# Altium schematic sheet Project_design.SchDoc
size A2; SheetNumber: 1; SheetTotal: 1
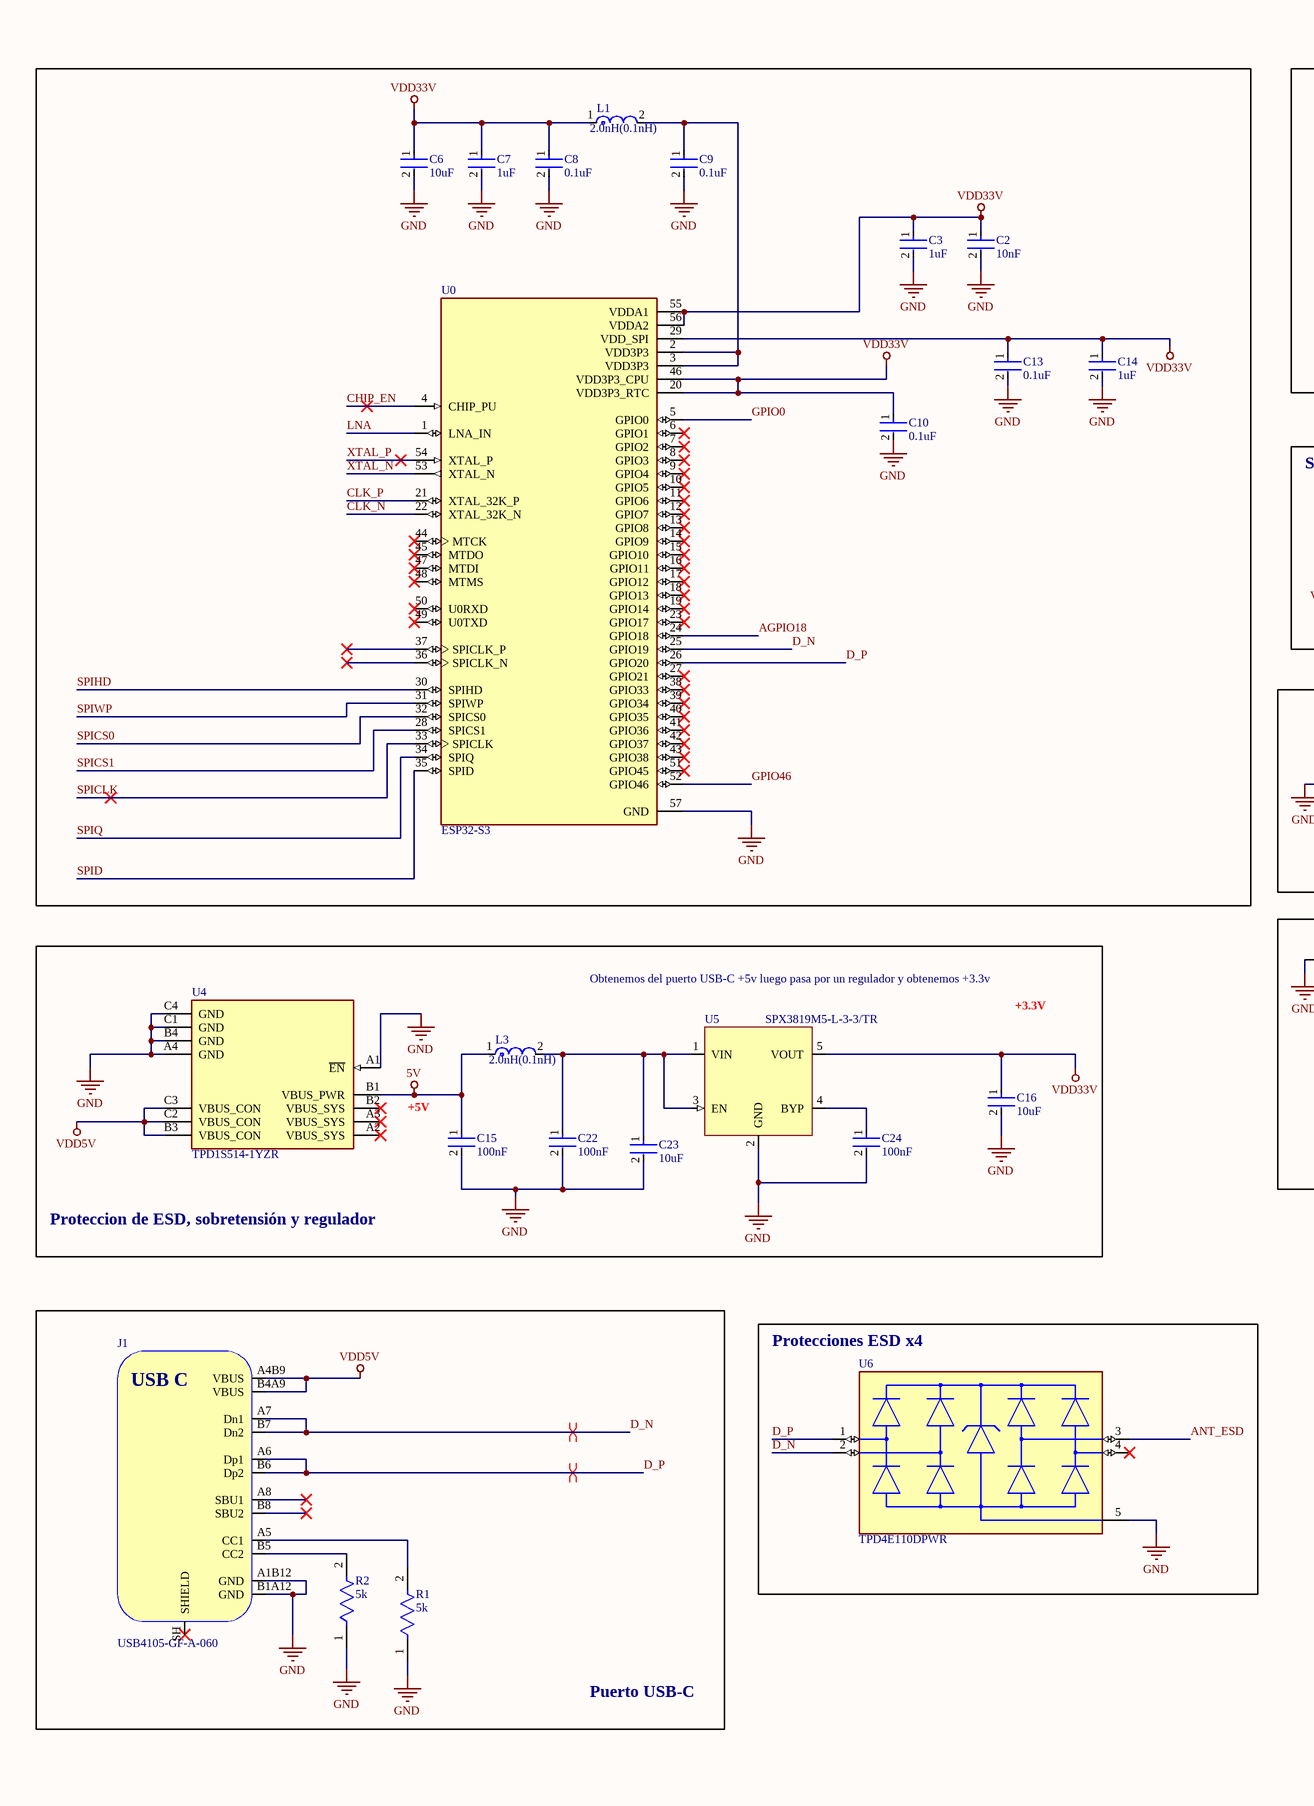
[diagram p0: Project_design.SchDoc, left]
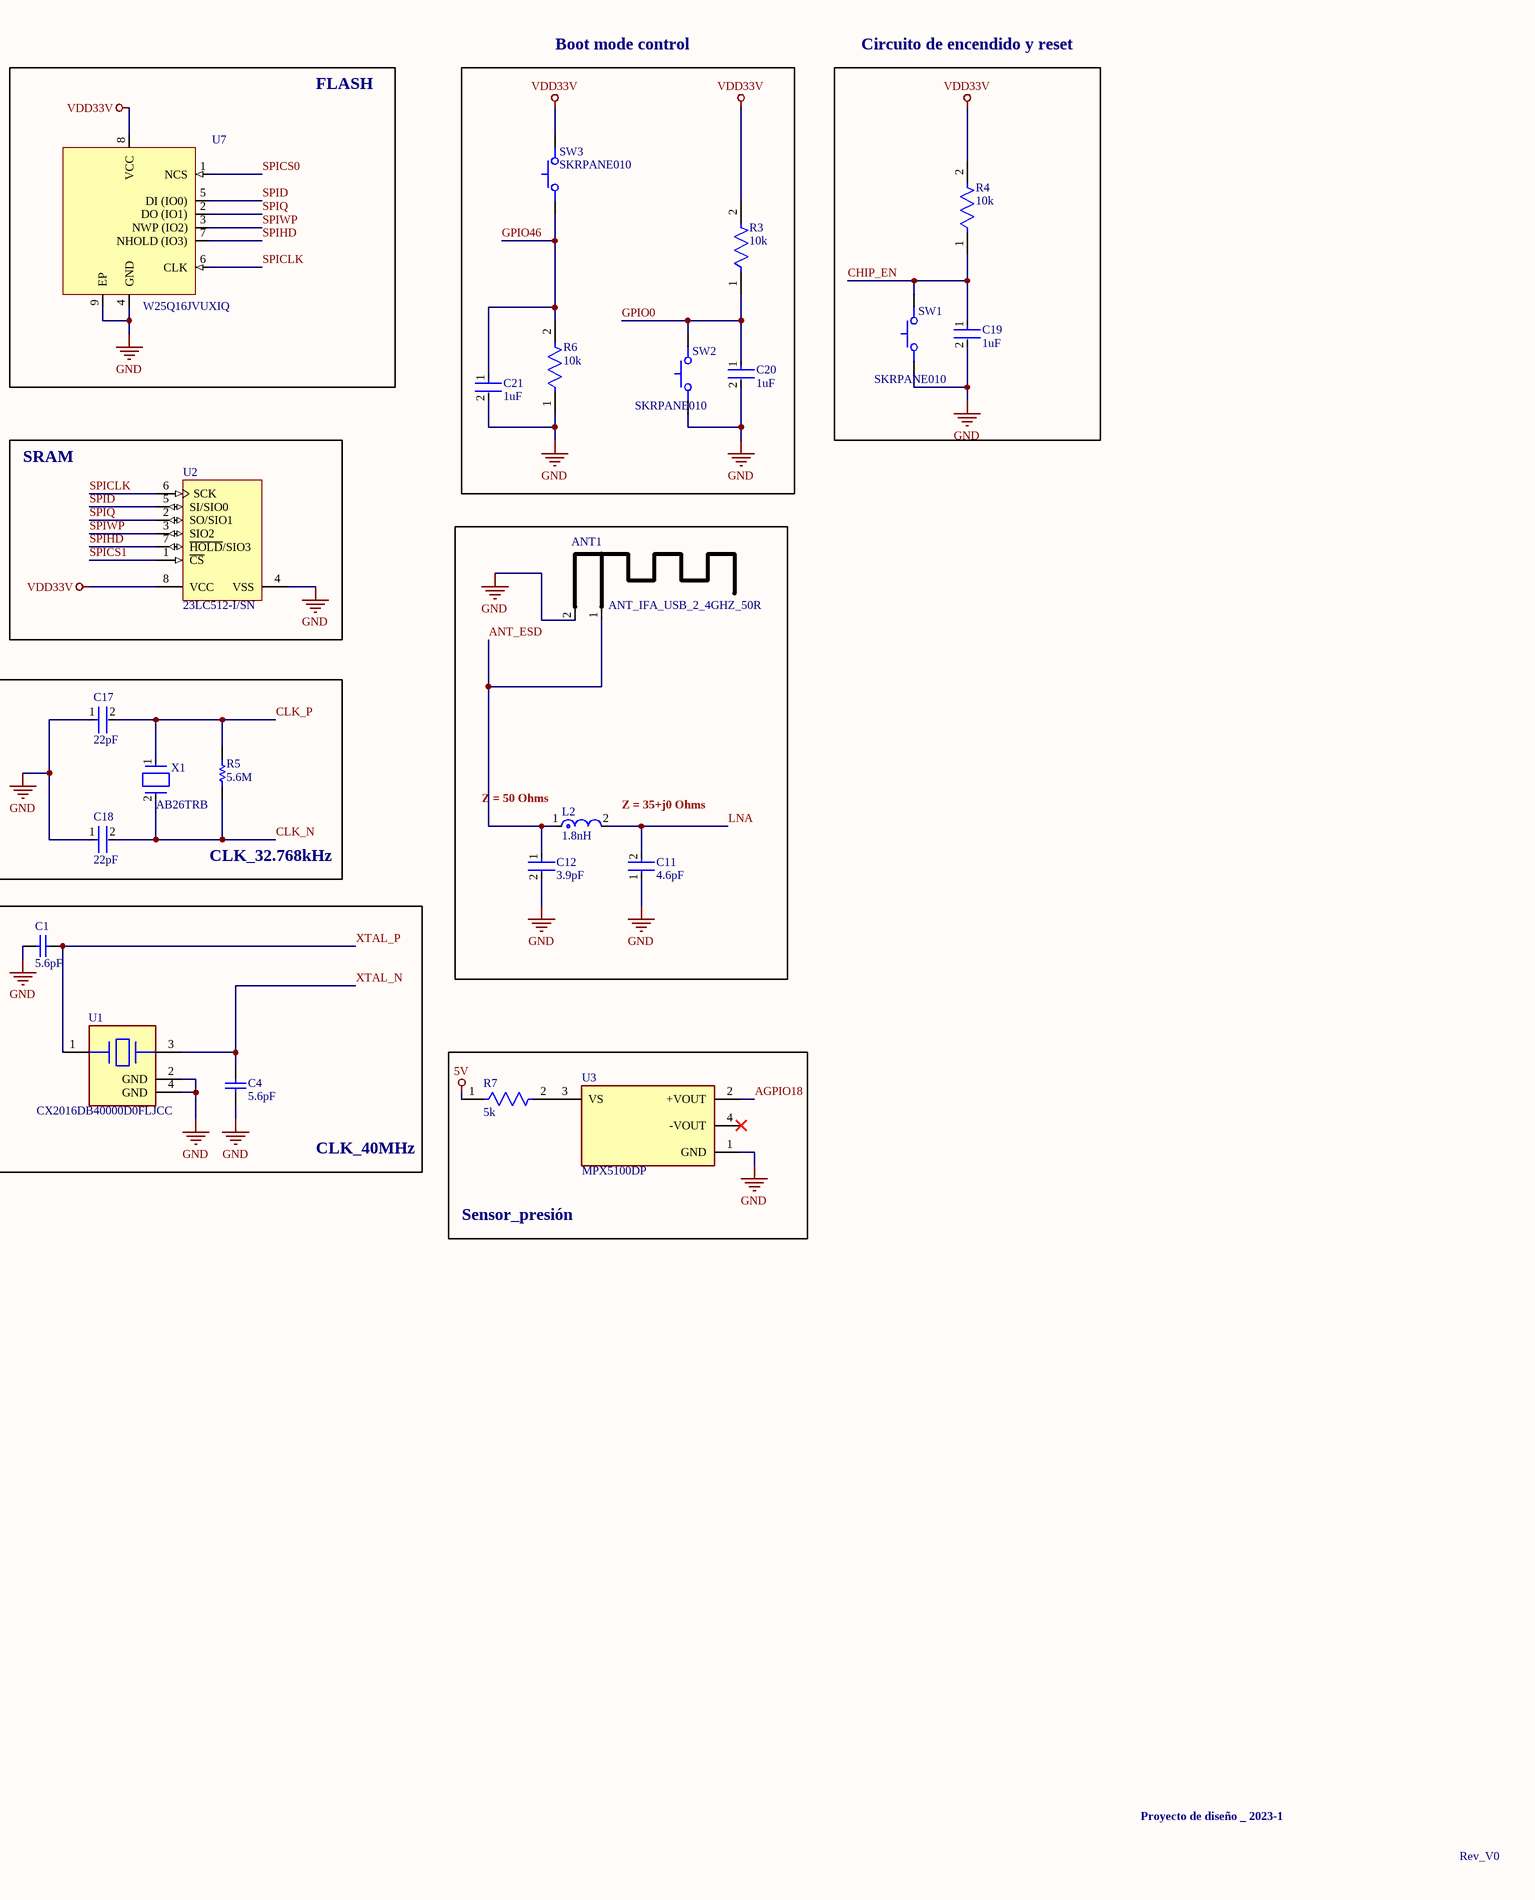
[diagram p1: Project_design.SchDoc, right]

## Parts
ANT1  ANT_IFA_USB_2_4GHZ_50R  [ANT_IFA_USB_2_4GHZ_50R]  (no BOM)
C1  5.6pF  [CAPC1006X50X20LL10T10]
C2  10nF  [FP-GRM033-0_03-IPC_B]
C3  1uF  [FP-C0402C105K9PACTU-MFG]
C4  5.6pF  [CAPC1006X50X20LL10T10]
C6  10uF  [FP-GRM155-0_2-IPC_C]
C7  1uF  [FP-C0402C105K9PACTU-MFG]
C8  0.1uF  [FP-CL278-IPC_C]
C9  0.1uF  [FP-CL278-IPC_C]
C10  0.1uF  [FP-CL278-IPC_C]
C11  4.6pF  [FP-CBR04C-MFG]
C12  3.9pF  [FP-GRM033-0_03-IPC_B]
C13  0.1uF  [FP-CL278-IPC_C]
C14  1uF  [FP-C0402C105K9PACTU-MFG]
C15  100nF  [FP-CL278-IPC_C]
C16  10uF  [FP-GRM155-0_2-IPC_C]
C17  22pF  [FP-C0603C-CF-MFG]
C18  22pF  [FP-C0603C-CF-MFG]
C19  1uF  [FP-C0402C105K9PACTU-MFG]
C20  1uF  [FP-C0402C105K9PACTU-MFG]
C21  1uF  [FP-C0402C105K9PACTU-MFG]
C22  100nF  [FP-CL278-IPC_C]
C23  10uF  [FP-GRM155-0_2-IPC_C]
C24  100nF  [FP-CL278-IPC_C]
J1  USB4105-GF-A-060  [USB4105-GF-A-060]
L1  2.0nH(0.1nH)  [FP-LQG15HH_02-MFG]
L2  1.8nH  [FP-LQP03TG_02-IPC_B]
L3  2.0nH(0.1nH)  [FP-LQG15HH_02-MFG]
R1  5k  [FP-PNM0402-IPC_C]
R2  5k  [FP-PNM0402-IPC_C]
R3  10k  [FP-CRGP0603-IPC_C]
R4  10k  [FP-CRGP0603-IPC_C]
R5  5.6M  [RESC1005X40X25ML05T10]
R6  10k  [FP-CRGP0603-IPC_C]
R7  5k  [FP-PNM0402-IPC_C]
SW1  SKRPANE010  [SKRPANE010]
SW2  SKRPANE010  [SKRPANE010]
SW3  SKRPANE010  [SKRPANE010]
U0  ESP32-S3  [IC_ESP32-S3]
U1  CX2016DB40000D0FLJCC  [FP-CX2016DB-MFG]
U2  23LC512-I/SN  [MCHP-SOIC-SN8_N]
U3  MPX5100DP  [FP-SOT1754-1-MFG]
U4  TPD1S514-1YZR  [BGA12N40P3X4_140X189X62N]
U5  SPX3819M5-L-3-3/TR  [SOT-23-5]
U6  TPD4E110DPWR  [FP-DPW0004A-MFG]
U7  W25Q16JVUXIQ  [USON-8-2X3MM]
X1  AB26TRB  [FP-AB26TRB-MFG]

## Blocks framed on the sheet
FLASH: U7
Boot mode control: C20 C21 R3 R6 SW2 SW3
Circuito de encendido y reset: C19 R4 SW1
SRAM: U2
CLK_32.768kHz: C17 C18 R5 X1
CLK_40MHz: C1 C4 U1
Proteccion de ESD, sobretensión y regulador: C15 C16 C22-C24 L3 U4 U5
Sensor_presión: R7 U3
Puerto USB-C: J1 R1 R2
Protecciones ESD x4: U6

## Nets
5V: C15.1 L3.1 R7.1 U4.B1(VBUS_PWR)
GND: ANT1.2(GND) C1.1 C2.2 C3.2 C4.1 C6.2 C7.2 C8.2 C9.2 C10.2 C11.1 C12.2 C13.2 C14.2 C15.2 C16.2 C17.1 C18.1 C19.2 C20.2 C21.2 C22.2 C23.2 C24.2 J1.A1B12(GND) J1.B1A12(GND) R1.1 R2.1 R6.1 SW1.12 SW2.12 U0.57(GND) U1.2(GND) U1.4(GND) U2.4(VSS) U3.1(GND) U4.A1(~{EN}) U4.A4(GND) U4.B4(GND) U4.C1(GND) U4.C4(GND) U5.2(GND) U6.5(GND) U7.4(GND) U7.9(EP)
VDD5V: J1.A4B9(VBUS) J1.B4A9(VBUS) U4.B3(VBUS_CON) U4.C2(VBUS_CON) U4.C3(VBUS_CON)
VDD33V: C2.1 C3.1 C6.1 C7.1 C8.1 C10.1 C13.1 C14.1 C16.1 L1.1 R3.2 R4.2 SW3.34 U0.20(VDD3P3_RTC) U0.29(VDD_SPI) U0.46(VDD3P3_CPU) U0.55(VDDA1) U0.56(VDDA2) U2.8(VCC) U5.5(VOUT) U7.8(VCC)
AGPIO18: U0.24(GPIO18) U3.2(+VOUT)
ANT_ESD: ANT1.1(RF) C12.1 L2.1 U6.3(IO3)
CHIP_EN: C19.1 R4.1 SW1.34 U0.4(CHIP_PU)
CLK_N: C18.2 R5.1 U0.22(XTAL_32K_N) X1.2
CLK_P: C17.2 R5.2 U0.21(XTAL_32K_P) X1.1
D_N: J1.A7(Dn1) J1.B7(Dn2) U0.25(GPIO19) U6.2(IO2)
D_P: J1.A6(Dp1) J1.B6(Dp2) U0.26(GPIO20) U6.1(IO1)
GPIO0: C20.1 R3.1 SW2.34 U0.5(GPIO0)
GPIO46: C21.1 R6.2 SW3.12 U0.52(GPIO46)
LNA: C11.2 L2.2 U0.1(LNA_IN)
SPICLK: U0.33(SPICLK) U2.6(SCK) U7.6(CLK)
SPICS0: U0.32(SPICS0) U7.1(NCS)
SPICS1: U0.28(SPICS1) U2.1(~{CS})
SPID: U0.35(SPID) U2.5(SI/SIO0) U7.5(DI_(IO0))
SPIHD: U0.30(SPIHD) U2.7(~{HOLD}/SIO3) U7.7(NHOLD_(IO3))
SPIQ: U0.34(SPIQ) U2.2(SO/SIO1) U7.2(DO_(IO1))
SPIWP: U0.31(SPIWP) U2.3(SIO2) U7.3(NWP_(IO2))
XTAL_N: C4.2 U0.53(XTAL_N) U1.3
XTAL_P: C1.2 U0.54(XTAL_P) U1.1
NetC9_1: C9.1 L1.2 U0.2(VDD3P3) U0.3(VDD3P3)
NetC22_1: C22.1 C23.1 L3.2 U5.1(VIN) U5.3(EN)
NetC24_1: C24.1 U5.4(BYP)
NetJ1_A5: J1.A5(CC1) R1.2
NetJ1_B5: J1.B5(CC2) R2.2
NetR7_2: R7.2 U3.3(VS)

Not connected (* = marked no-connect by the designer): J1 A8(SBU1)* B8(SBU2)* SH(SHIELD)*; U0 6(GPIO1)* 7(GPIO2)* 8(GPIO3)* 9(GPIO4)* 10(GPIO5)* 11(GPIO6)* 12(GPIO7)* 13(GPIO8)* 14(GPIO9)* 15(GPIO10)* 16(GPIO11)* 17(GPIO12)* 18(GPIO13)* 19(GPIO14)* 23(GPIO17)* 27(GPIO21)* 36(SPICLK_N)* 37(SPICLK_P)* 38(GPIO33)* 39(GPIO34)* 40(GPIO35)* 41(GPIO36)* 42(GPIO37)* 43(GPIO38)* 44(MTCK)* 45(MTDO)* 47(MTDI)* 48(MTMS)* 49(U0TXD)* 50(U0RXD)* 51(GPIO45)*; U3 4(-VOUT)*; U4 A2(VBUS_SYS)* A3(VBUS_SYS)* B2(VBUS_SYS)*; U6 4(IO4)*

## Layout directives
differential pair: D_N, D_P

## Notes on the sheet
- (near L2) Z = 50 Ohms
- (near L2) Z = 35+j0 Ohms
- Obtenemos del puerto USB-C +5v luego pasa por un regulador y obtenemos +3.3v
- +3.3V
- +5V
- Proyecto de diseño _ 2023-1
- Rev_V0
- (in symbol CMP-002-00129-1) USB C

## Library data of the parts
ANT1 = CMP-027-000136-1: Inverted F 2.4GHz ISM PCB Antenna 50 Ohm; Source: Schematic-Lib-PhilsLab.SchLib; Design Item ID: ANT_IFA_USB_2_4GHZ_50R; ComponentLink1URL: https://www.ti.com/lit/an/swra117d/swra117d.pdf; ComponentLink1Description: Datasheet
C1 C4 = CMP-2008-04814-1: Manufacturer: AVX Interconnect / Elco; Part Number: 04023J5R6BBSTR
C2 = CMP-2010-01684-2: Chip Multilayer Ceramic Capacitors for General Purpose, 0201, 10000pF, X7R, 15%, 10%, 10V; Package Quantity: 1; Width: 0.012inch; Voltage: 10V; Mount: Surface Mount; Capacitance: 10nF; Voltage Rating (DC): 10V; Voltage Rating: 10V; Length: 0.6mm; Packaging: Tape and Reel; Material: Ceramic; Dielectric: X7R; REACH SVHC: No SVHC; Termination: SMD/SMT; Case/Package: 0201; Radiation Hardening: No; Height: 0.3mm; Tolerance: 10%; Case Code (Imperial): 0201; Min Operating Temperature: -55°C; Lead Free: Lead Free; Thickness: 0.013inch; Depth: 0.3mm; Case Code (Metric): 0603; Max Operating Temperature: 125°C
C3 C7 C14 C19-C21 = CMP-2008-02075-2: CAP CER 1UF 6.3V X5R 0402; Tolerance: 10%; Dielectric Material: Ceramic; Series: C; Lead Free: Lead Free; Min Operating Temperature: -55°C; Capacitance: 1uF; Voltage Rating (DC): 6.3V; Number of Pins: 2; REACH SVHC: No SVHC; Mount: Surface Mount; Lead Pitch: 0.3mm; Case Code (Imperial): 0402; RoHS Compliant: Yes; Radiation Hardening: No; Construction: Flat; Depth: 0.5mm; Case/Package: 0402; Termination: SMD/SMT; Height: 0.5mm; Thickness: 0.022inch; Voltage: 6.3V; Dielectric: X5R; Width: 0.02inch; Voltage Rating: 6.3V; Max Operating Temperature: 85°C; Packaging: Tape and Reel; Package Quantity: 1; Length: 1mm
C6 C16 C23 = CMP-06035-044652-1: Chip Multilayer Ceramic Capacitors for General Purpose, 0402, 10uF, X5R, 15%, 20%, 6.3V
C8-C10 C13 C15 C22 C24 = CMP-13271-000728-1: Cap Ceramic 100nF 25V X5R ±10% SMD 0402 +85°C Paper T/R; Package Quantity: 1; Height: 0.5mm; Case Code (Metric): 1005; Thickness: 0.022inch; Mount: Surface Mount; Lead Free: Lead Free; Case Code (Imperial): 0402; Packaging: Tape and Reel; Depth: 0.5mm; Voltage: 25V; Min Operating Temperature: -55°C; Voltage Rating: 25V; Dielectric: X5R; Case/Package: 0402; Tolerance: 10%; Width: 0.02inch; Max Operating Temperature: 85°C; Capacitance: 100nF; Length: 1mm; Radiation Hardening: No; Voltage Rating (DC): 25V
C11 = CMP-03020-033502-1: CBR0402 4.6 pF 30ppm/°C 0.1 pF C0G 50 V; Manufacturer Part Number: CBR04C469B5GAC; Manufacturer: KEMET; Tolerance: 0.1 pF; Voltage Rating: 50 V; Material: Ceramic; Device Class L1: Passive Components; Package: CBR04C; Value: 4.6 pF; ComponentLink2Description: Datasheet; Automotive: No; Device Class L2: Capacitors; Device Class L3: Ceramic Capacitors; Temperature: -55°C to +125°C; Category: Cap; Temperature Coefficient: 30ppm/°C; Lead Free: Yes; Temperature Characteristic: C0G; Mouser Description: Cap Ceramic 4.6pF 50V C0G 0.1pF SMD 0402 125°C Paper T/R; Capacitance: 4.6 pF; Ipc Land Pattern Name: CAPC10050X50; Height: 0.55mm; RoHS: TRUE; ComponentLink2URL: https://content.kemet.com/datasheets/KEM_C1030_CBR_SMD.pdf; Octopart: https://octopart.com/cbr04c469b5gac-kemet-86730458; Temperature Range High: +125°C; Temperature Range Low: -55°C
C12 = CMP-2010-01120-2: Chip Multilayer Ceramic Capacitors for General Purpose, 0201, 3.9pF, C0G, 30ppm/°C, 0.25pF, 50V; Width: 0.012inch; Thickness: 0.013inch; Length: 0.024inch; Voltage Rating (DC): 50V; Case/Package: 0201; Termination: SMD/SMT; Min Operating Temperature: -55°C; Voltage Rating: 50V; Packaging: Tape and Reel; Max Operating Temperature: 125°C; Capacitance: 3.9pF; Mount: Surface Mount; Package Quantity: 15000
C17 C18 = CMP-2006-03119-3: Cap Ceramic 22pF 50V C0G 5% SMD 0603 125°C Paper T/R; Manufacturer Part Number: C0603C220J5GACTU; Manufacturer: KEMET; Temperature Coefficient: 30ppm/°C; Automotive Grade: Grade 1; Tolerance: 0.05; RoHS: TRUE; Temperature Characteristic: C0G; Capacitance: 22 pF; Device Class L3: Ceramic Capacitors; Digikey Description: Cap Ceramic 22pF 50V C0G 5% SMD 0603 125°C Paper T/R; ComponentLink2URL: https://api.kemet.com/component-edge/download/datasheet/C0603C100J5GACAUTO.pdf; ComponentLink2Description: Datasheet; Automotive: Yes; Temperature: -55°C to +125°C; Temperature Range High: +125°C; Package: C0603C-CF; Device Class L1: Passive Components; Device Class L2: Capacitors; Lead Free: Yes; Value: 22 pF; Category: Cap; Mouser Description: Cap Ceramic 22pF 50V C0G 5% SMD 0603 125°C Paper T/R; Voltage Rating: 50 V; Height: 0.87mm; Material: Ceramic; Temperature Range Low: -55°C; Octopart: https://octopart.com/c0603c220j5gactu-kemet-98525
J1 = CMP-002-00129-1: USB Connector Type C SMT 12 Pin; Manufacturer: GCT; Distributor Link: https://eu.mouser.com/ProductDetail/GCT/USB4105-GF-A-060?qs=QNEnbhJQKvY2mocwNJzgfA%3D%3D; Manufacturer Part Number: USB4105-GF-A-060; Source: Schematic-Lib-PhilsLab.SchLib; Design Item ID: USB4105-GF-A-060
L1 L3 = CMP-06042-013960-1: Multilayer type RF Inductor 2nH ±0.1nH 0.09Ω 900mA 0402
L2 = CMP-06042-011516-1: Film type RF Inductor 1.8nH ±0.1nH 600mA 0.15Ω 0201 (0603); Self Resonant Frequency: 6GHz; Current: 450mA; Q Factor: 14; Test Frequency: 500MHz; Shielding: Unshielded; DC Resistance (DCR): 150mR; Core Material: Non-Magnetic; Termination: SMD/SMT; Height - Seated (Max): 0.013inch; Package Quantity: 15000; Case/Package: 0201; Depth: 0.33mm; REACH SVHC: No SVHC; Length: 0.024inch; Case Code (Imperial): 0201; DC Current: 600mA; Packaging: Tape and Reel; Current Rating: 600mA; Radiation Hardening: No; Inductance: 1.8nH; Resistor Type: Thin Film; Mount: Surface Mount; Max Operating Temperature: 125°C; Height: 0.012inch; Case Code (Metric): 0603; Military Standard: Not; Min Operating Temperature: -55°C; Width: 0.012inch; Max DC Current: 600mA
R1 R2 R7 = CMP-02407-012302-1: RES SMD 5K OHM 0.1% 1/20W 0402; Temperature Coefficient: 25ppm/°C; Resistance: 5kR; Max Power Dissipation: 50mW; Width: 0.022inch; Height: 0.033inch; Tolerance: 0.1%; Number of Terminations: 2; Packaging: Tape and Reel; RoHS Compliant: Yes; Case Code (Imperial): 0402; Min Operating Temperature: -55°C; Case Code (Metric): 1005; Features: Moisture Resistant; Max Operating Temperature: 155°C; Package Quantity: 1000; Resistor Type: Thin Film; Length: 0.042inch; Case/Package: 0402
R3 R4 R6 = CMP-03211-004414-1: CRGP 0603 10K 1%; Manufacturer Part Number: CRGP0603F10K; Manufacturer: TE; Voltage Rating: 50V; Power Rating: 0.25W; Value: 10KΩ; Tolerance: 0.01; Temperature Coefficient: ±100ppm/°C; Octopart: https://octopart.com/crgp0603f10k-te+connectivity-91018721; Temperature Range Low: -55°C; Temperature Range High: +155°C; Device Class L3: Chip SMD Resistors; Package: CRGP0603; Height: 0.55mm; Series: CRGP; RoHS: TRUE; Composition: Thick Film; Digikey Description: CRGP 0603 10K 1%; Ipc Land Pattern Name: RESC16080X45; Mouser Description: Res, 10K, 1%, 0.25W, 0603, Thick Film; ComponentLink2Description: Datasheet; ComponentLink2URL: https://www.te.com/commerce/DocumentDelivery/DDEController?Action=srchrtrv&DocNm=9-1773463-9&DocType=DS&DocLang=English; Temperature: -55°C to +155°C; Device Class L1: Passive Components; Lead Free: Yes; Ambient Temperature Range High: +70°C; Device Class L2: Resistors; Automotive: No; Category: Res; Resistance: 10KΩ
R5 = CMP-2002-07139-1: Manufacturer: Yageo / Phycomp; Part Number: RC0402JR-075M6L
SW1-SW3 = SKRPANE010: Tactile Switch SMD SPST; Manufacturer: Alps Alpine; Manufacturer Part Number: SKRPANE010
  SW1: Supplier 1: Mouser; Supplier Part Number 1: 688-SKRPANE010
U0 = CMP-031-00008-2: IC RF TxRx + MCU Bluetooth, WiFi 802.11b/g/n, Bluetooth v5.0 2.412GHz ~ 2.484GHz 56-VFQFN Exposed Pad; MF: Espressif Systems; Availability: In Stock; Value: *; Pins: 57; Price: None; Purchase-URL: https://pricing.snapeda.com/search/part/ESP32-S3/?ref=eda; Component Type: Standard; Case/Package: None; Check_prices: https://www.snapeda.com/parts/ESP32-S3/Espressif+Systems/view-part/?ref=eda; Design Item ID: ESP32-S3; MP: ESP32-S3; Source: ESP32-S3.SchLib; SnapEDA_Link: https://www.snapeda.com/parts/ESP32-S3/Espressif+Systems/view-part/?ref=snap
U1 = CMP-20727-000002-1: CRYSTAL 40.0000MHZ 8PF SMD; Manufacturer: Kyocera International Inc. Electronic Components; Esr: 50Ω; Tolerance: 15ppm; Frequency: 40MHz; Series: CX2016DB; RoHS: TRUE; Temperature Range High: +85°C; Height: 0.45mm; Manufacturer Part Number: CX2016DB40000D0FLJCC; ComponentLink2Description: Datasheet; Load Capacitance: 8pF; ComponentLink2URL: https://global.kyocera.com/prdct/electro/product/pdf/cx2016db_e.pdf; Temperature: -30°C to +85°C; Device Class L2: Crystals / Oscillators; Category: Crys; Mouser Description: Crystal 40MHz 8pF 4-Pin SMD T/R; Lead Free: Yes; Device Class L3: Crystals; Temperature Range Low: -30°C; Octopart: https://octopart.com/cx2016db40000d0fljcc-avx+%2F+kyocera-71139660; Device Class L1: Passive Components; Automotive: No; Digikey Description: CRYSTAL 40.0000MHZ 8PF SMD; Package: CX2016DB; Stability: 15ppm
U2 = CMP-0163-00041-1: 512K bits SPI Serial SRAM with SDI and SQI Interface, 2.5 to 5.5 V, 20 MHz, -40 to 85 degC, 8-pin SOIC (SN8), Tube; Manufacturer: Microchip; ComponentLink1Description: Manufacturer URL; DatasheetVersion: Rev. A; ComponentLink3Description: Package Specification; ComponentLink2URL: http://ww1.microchip.com/downloads/en/DeviceDoc/25155A.pdf; ComponentLink4Description: Product URL; ComponentLink4URL: http://www.microchip.com/23LC512; PackageReference: SOIC-SN8; PackageVersion: C04-057C; ComponentLink1URL: http://www.microchip.com; ComponentLink2Description: Datasheet; PackageDescription: 8-Lead Plastic Small Outline, 4.9 x 3.9 mm Body, 1.27 mm Pitch; ComponentLink3URL: http://www.microchip.com/stellent/groups/techpub_sg/documents/packagingspec/en012702.pdf; PartNumber: 23LC512-I/SN; Mounting Technology: Surface Mount
U3 = CMP-00561-70301700-1: Pressure Sensor 14.5PSI (100kPa) Differential Male - 0.19 (4.93mm) Tube, Dual 0.2 V ~ 4.7 V 6-SIP Module; Accuracy: 0.4%; Port Style: Barbed; Min Supply Voltage: 3V; Response Time: 1ms; Max Pressure: 25.38PSI; Operating Supply Current: 6mA; Output Type: Wheatstone Bridge; Max Supply Voltage: 6V; Height: 33.09mm; NexarPartId: 70301700; Case/Package: SIP; Weight: 5.057838g; Max Operating Temperature: 125°C; REACH SVHC: No SVHC; Min Operating Temperature: -40°C; Lead Free: Lead Free; Termination: PCB; Nominal Supply Current: 6mA; Packaging: Bulk; Radiation Hardening: No; Mount: Through Hole; RoHS: Compliant; Number of Pins: 4; Pressure Type: Differential; Ambient Temperature Range High: 125°C; Schedule B: 8541500080, 8542390000
U4 = CMP-003-000016-2: Interface Circuit, PBGA12; MF: Texas Instruments; Max Supply Voltage: 5.9V; Min Supply Voltage: 3.5V; Texas_Instruments-Purchase-URL: https://snapeda.com/shop?store=Texas+Instruments&id=382764; Availability: Good; JESD-609 Code: e1; Value: *; Max Operating Temperature: 85°C; Component Type: Standard; Source: TPD1S514-1YZR.SchLib; Package: DSBGA-12 Texas Instruments; MP: TPD1S514-1YZR; Pins: 12; Case/Package: VFBGA; Height - Seated (Max): 0.625mm; Pin Count: 12; SnapEDA_Link: https://www.snapeda.com/parts/TPD1S514-1YZR/Texas%20Instruments/view-part/382764/?ref=snap; Interface IC Type: INTERFACE CIRCUIT; Min Operating Temperature: -40°C; DigiKey-Purchase-URL: https://snapeda.com/shop?store=DigiKey&id=382764; Design Item ID: TPD1S514-1YZR; Length: 1.99mm; RoHS Compliant: Yes; Price: None; Mouser-Purchase-URL: https://snapeda.com/shop?store=Mouser&id=382764
U5 = CMP-027-000125-1: 500mA +3.3V Low-Noise LDO Voltage Regulator; Manufacturer: MaxLinear; Design Item ID: SPX3819M5-L-3-3/TR; Manufacturer Part Number: SPX3819M5-L-3-3/TR; Source: Schematic-Lib-PhilsLab.SchLib
U6 = CMP-04985-000023-1: TVS DIODE 5.5VWM 13VC 4X2SON; Capacitance: 0.55pF; Direction: Unidirectional; Leakage Current: 20nA; Operating Supply Voltage: 5.5V; Peak Pulse Power: 35W; Number of Channels: 4; Peak Pulse Current: 5A; Interface: USB; Min Breakdown Voltage: 6.5V; Clamping Voltage: 13V; Power Line Protection: Yes; Max Operating Temperature: 125°C; Lead Free: Lead Free; Mount: Surface Mount; Radiation Hardening: No; Number of Pins: 4; REACH SVHC: No SVHC; Min Operating Temperature: -40°C; Packaging: Cut Tape; Working Voltage: 5.5V; Number of Unidirectional Channels: 4; Length: 0.85mm; RoHS Compliant: Yes; Depth: 0.85mm; Reverse Standoff Voltage: 5.5V
U7 = CMP-031-00019-1: 16M-BIT SERIAL FLASH MEMORY WITH DUAL/QUAD SPI USON-8; Manufacturer: Winbond; Design Item ID: W25Q16JVUXIQ; LCSC: C2843335; Manufacturer Part Number: W25Q16JVUXIQ; Source: Schematic-Lib-PhilsLab.SchLib
X1 = CMP-27762-006068-1: CRYSTAL 32.7680KHZ 12.5PF TH; Frequency Stability: -0.034ppm; Frequency Tolerance: 20ppm; Frequency: 32.768kHz; Operating Frequency: 32.768 kHz; Series Resistance: 50kR; Case/Package: Radial; Package Quantity: 500; Packaging: Tape and Reel; Lead Pitch: 2.54mm; Termination: Radial; Mount: Surface Mount; Min Operating Temperature: -40°C; REACH SVHC: No SVHC; Load Capacitance: 12.5pF; Lead Free: Lead Free; Max Operating Temperature: 85°C; Length: 6mm; Height: 0.075inch; Depth: 1.9mm; Tolerance: 20ppm; ESR (Equivalent Series Resistance): 50kR; Number of Pins: 2; Series: AB26TRB